# EAGLE board Tyr V4 (EAGLE 9.5.1), part 1 of 2
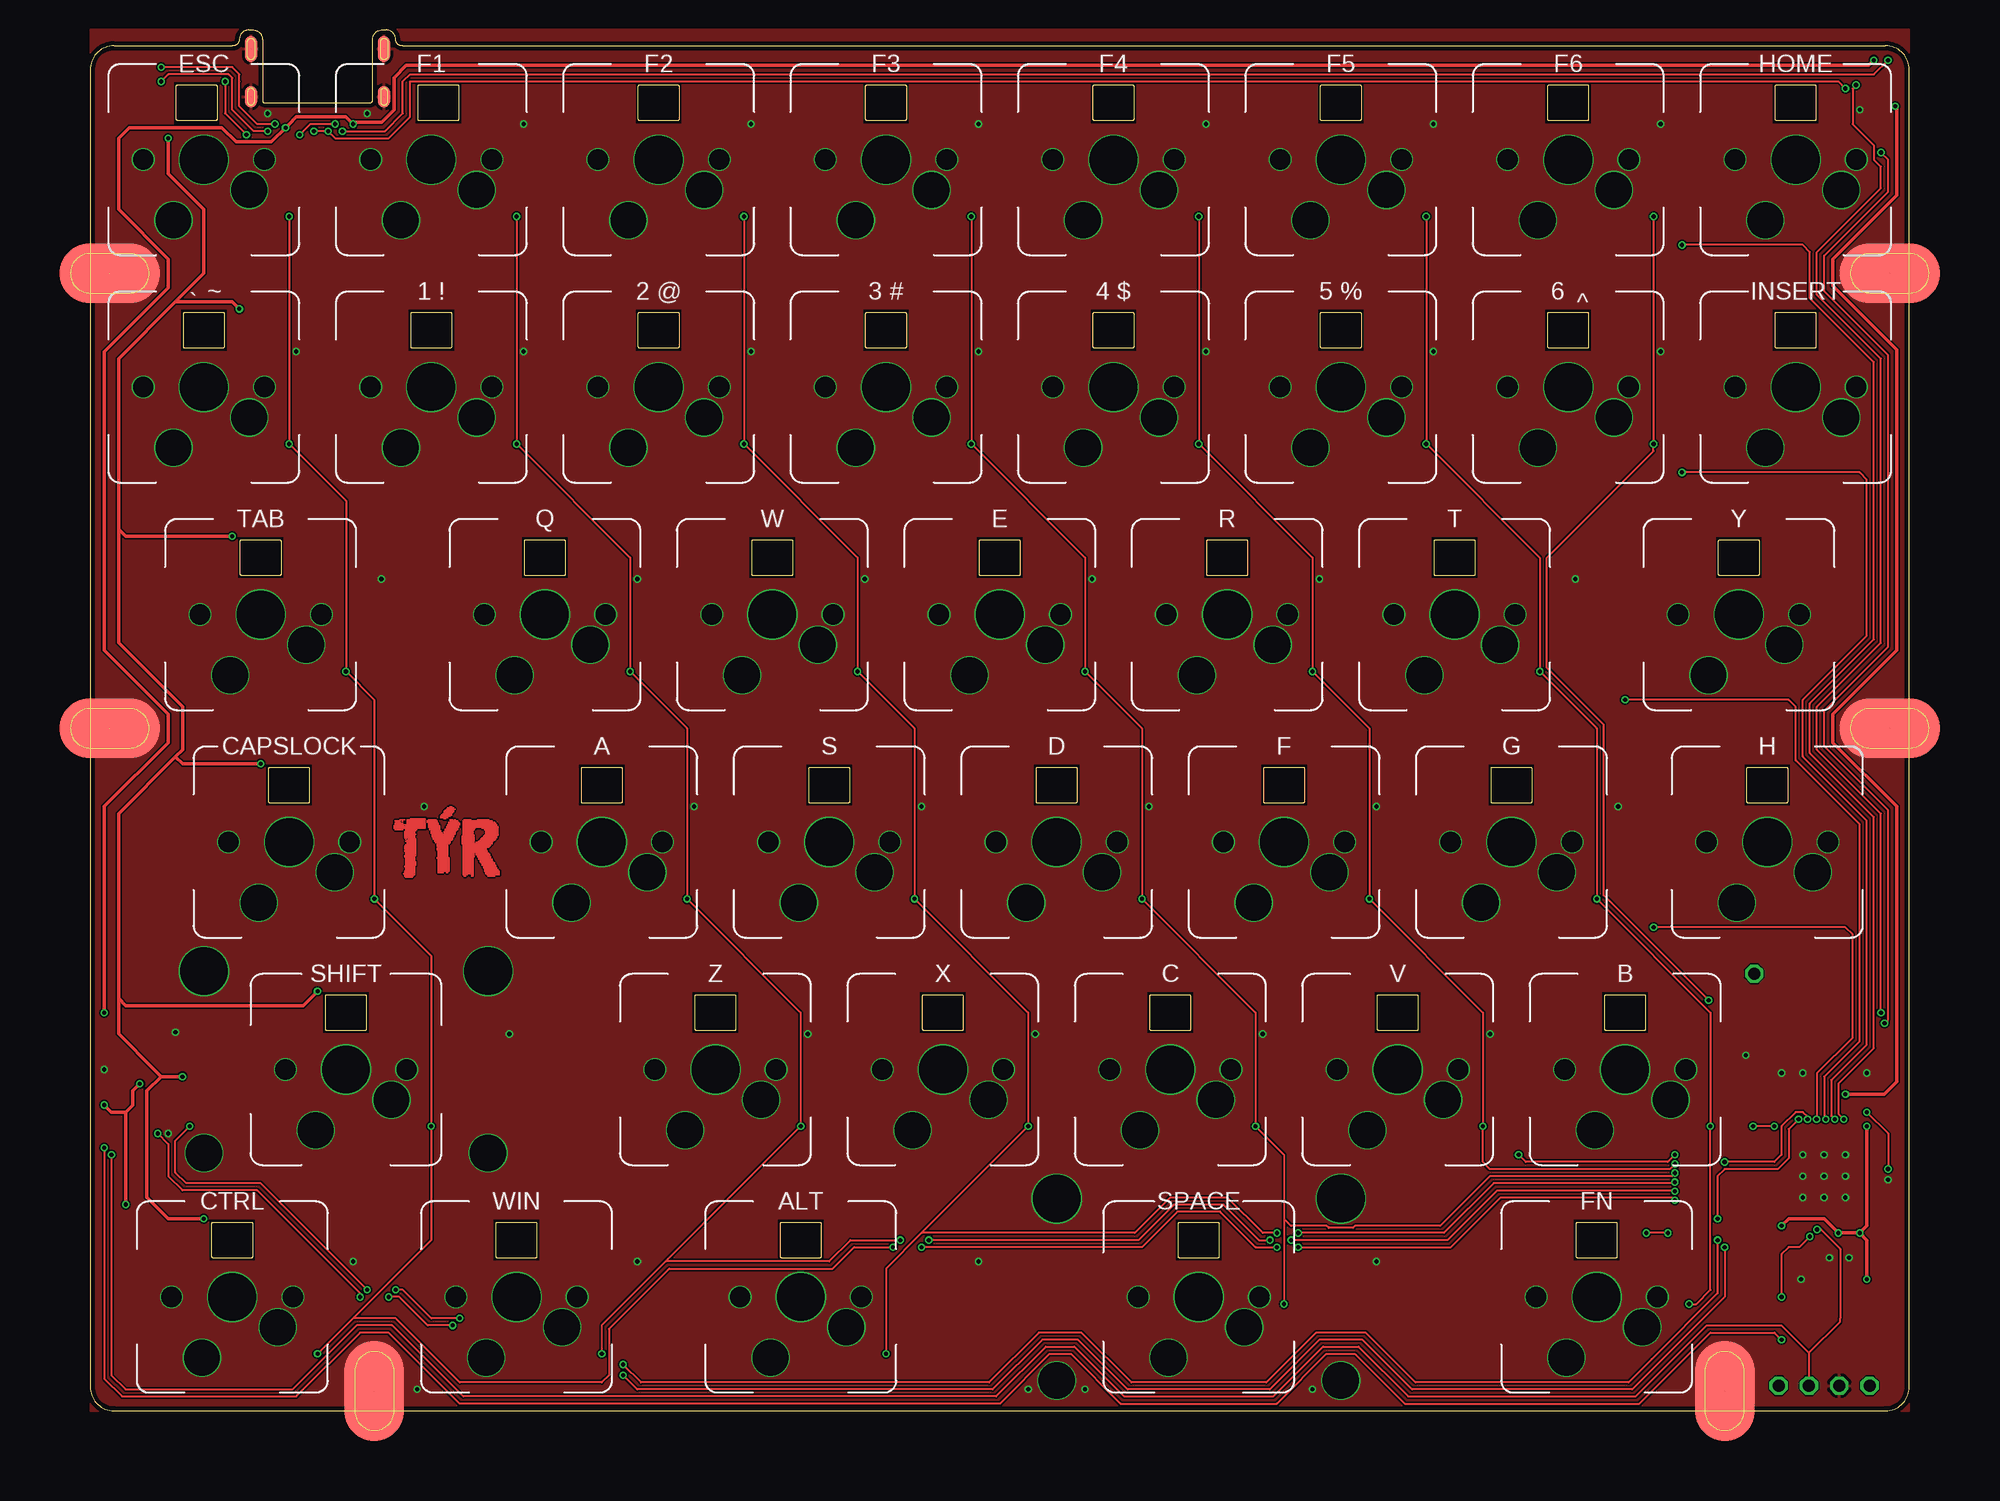
[diagram p3: board, top side]
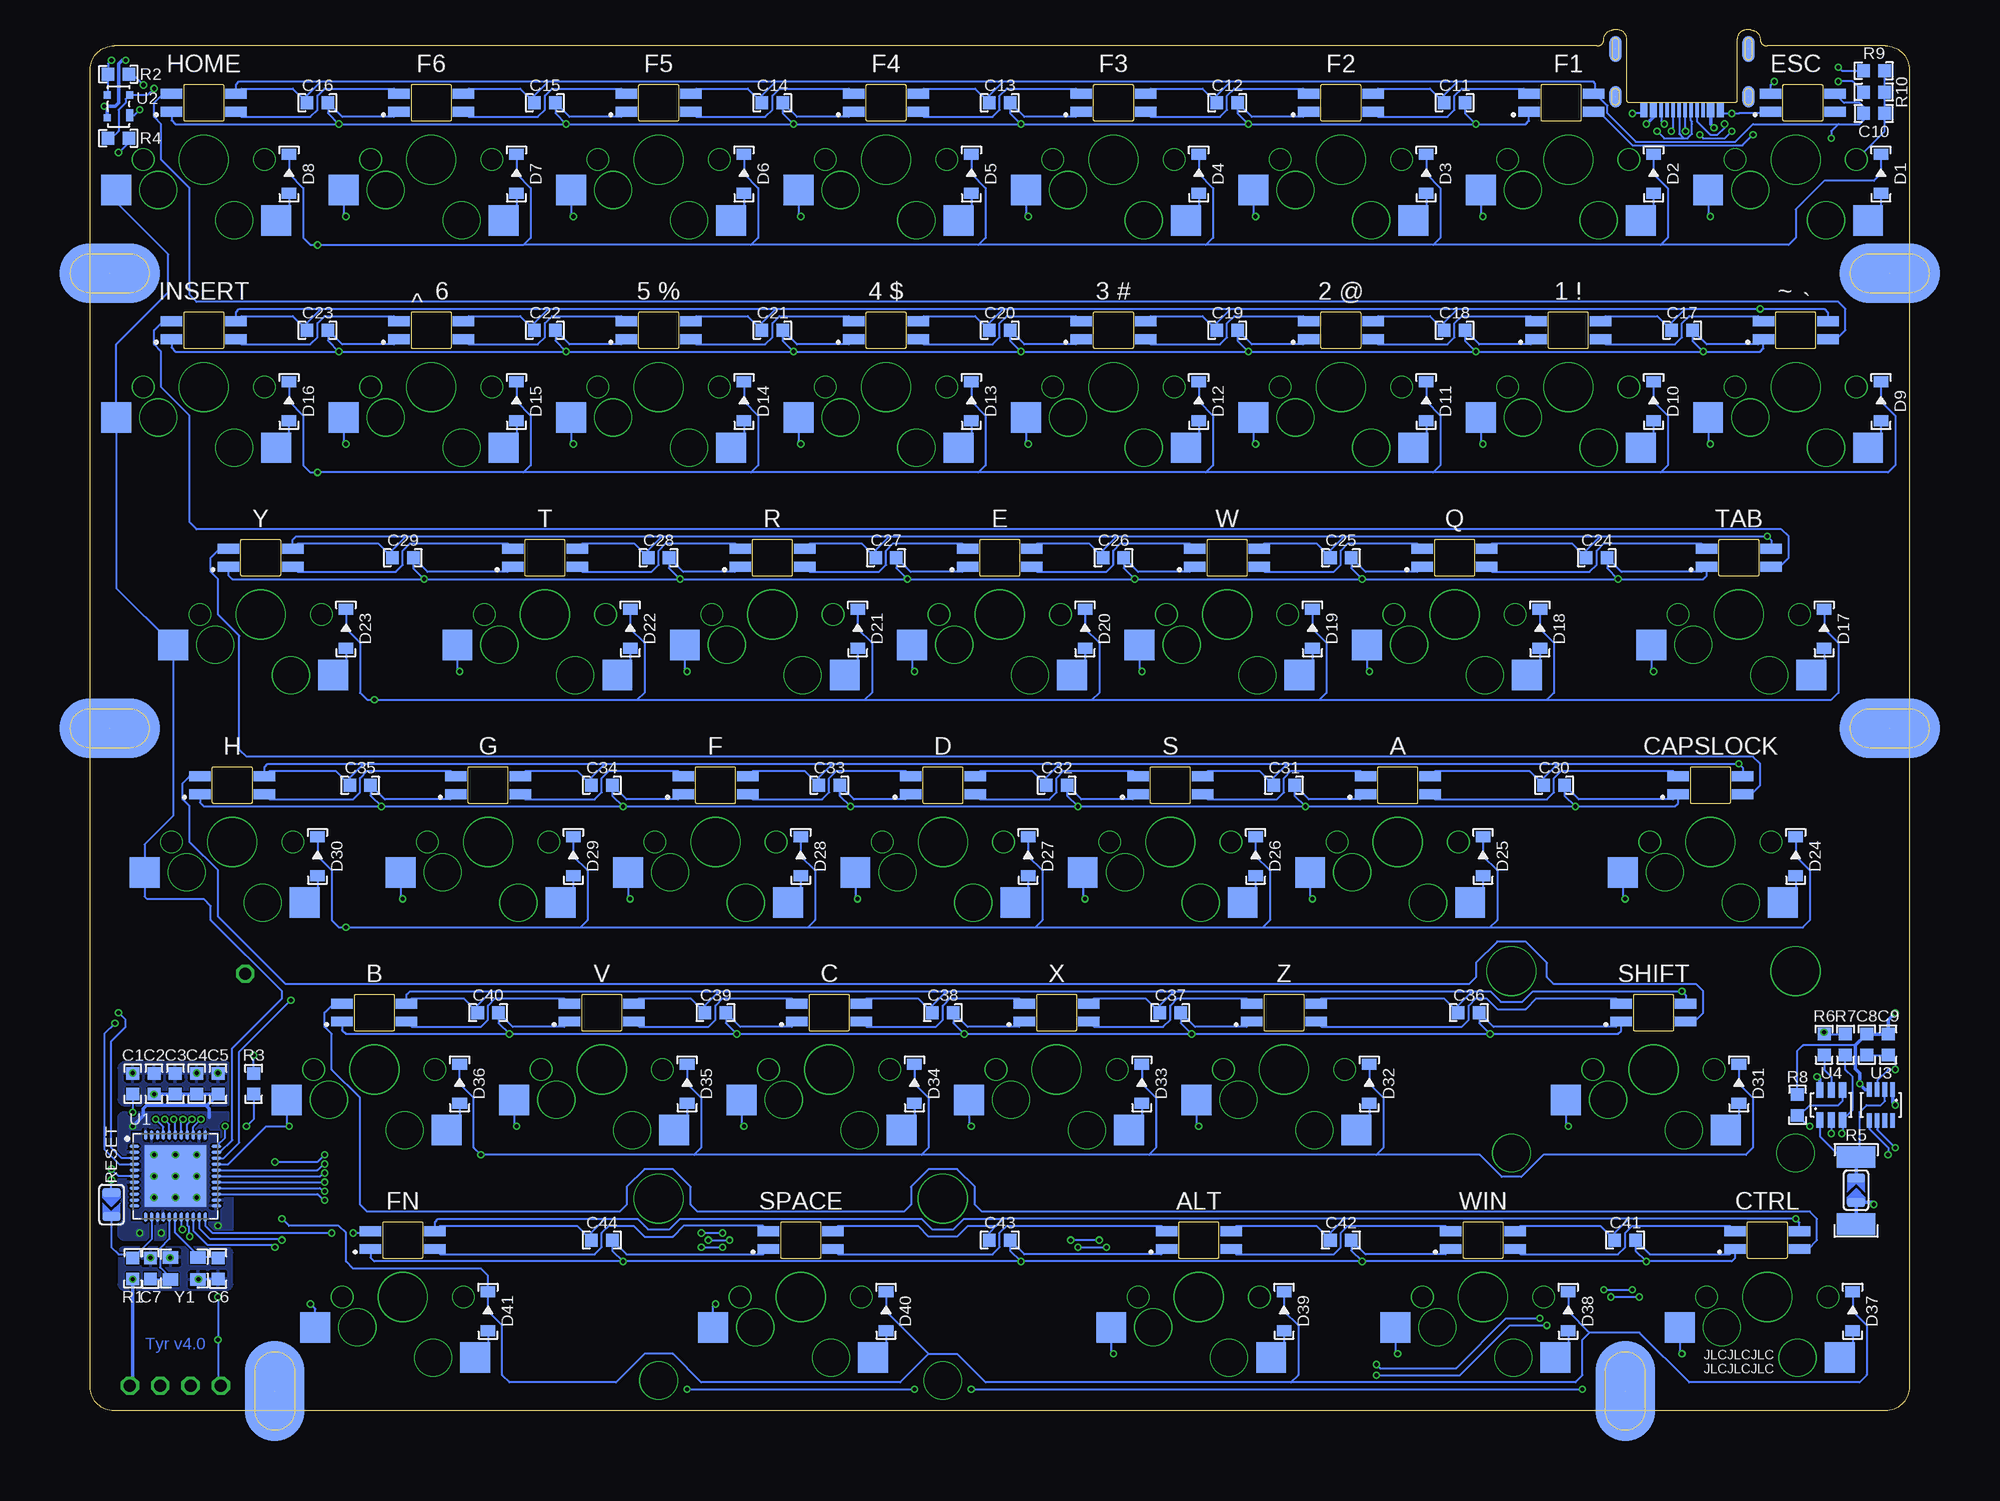
[diagram p4: board, bottom side, seen from below]

Size 152.4 x 115.64 mm. Coordinates in mm from the lower left corner, seen from the top.
Outline: 152.4,2 152.4,112.3 arc90 150.4,114.3 26.19,114.3 26.14,114.3 arc-90 25.6,114.84 arc90 24.8,115.64 24.46,115.64 arc90 23.66,114.84 23.66,109.74 arc-90 23.46,109.54 14.64,109.54 arc-90 14.44,109.74 14.44,114.84 arc90 13.64,115.64 13.3,115.64 arc90 12.5,114.84 arc-90 11.96,114.3 11.91,114.3 2,114.3 arc90 0,112.3 0,2 arc90 2,0 150.4,0 arc90 152.4,2
Copper layers (1*16): Top 0.035559375mm / dielectric 1.6mm / Bottom 0.035559375mm
Design rules "oshpark-2layer *": minimum track width 5mil, minimum drill 10mil, track to track 5mil, track to pad 6mil, pad to pad 6mil, via to via 6mil, smd to smd 6mil, copper to edge 15mil, drill to drill 6mil, minimum pad ring 3mil, minimum via ring 5mil, stop-mask expansion 2.5mil, vias tented up to drill 20mil, thermal gap 10mil
tRestrict: area 14.3,109.2 to 23.8,115.8
bRestrict: area 14.3,109.2 to 23.8,115.8

## Footprints (pad centres in the part's own frame; a part is rotated, then mirrored left to right if it is on the bottom)
KEYBOARD_MX-1U-HOTSWAP = drill 4 pad 4.2: HOLE1 0,0 | drill 3 pad 3.2: HOLE2 2.54,5.08; HOLE3 -3.81,2.54 | drill 1.7 pad 1.9: HOLE4 -5.08,0; HOLE5 5.08,0 | smd 2.5 x 2.55 bottom: P$1 -7.335,2.54; P$2 6.065,5.08
COMPONENTS_C0603 = smd 1.05 x 1.08: 1 -0.875,0; 2 0.875,0
KEYBOARD_MX-1U-HOTSWAP-CAPSLOCK = drill 4 pad 4.2: HOLE1 0,0 | drill 3 pad 3.2: HOLE2 2.54,5.08; HOLE3 -3.81,2.54 | drill 1.7 pad 1.9: HOLE4 -5.08,0; HOLE5 5.08,0 | smd 2.5 x 2.55 bottom: P$1 -7.335,2.54; P$2 6.065,5.08
COMPONENTS_SOD-123 = smd 0.91 x 1.22: A -1.635,0; C 1.635,0
HOLE_M3_OVAL = smd 8.4 x 5 bottom: P$1 0,0 | smd 8.4 x 5: P$2 0,0
TYR_TYR_DISPLAY = drill 1.016 pad 1.524 octagon: 5 1.288,36.6; GND 8.414,2.1; SCL 5.874,2.1; SDA 3.334,2.1; VIN 10.954,2.1
TYR_WS2812B_3528_REVERS-MOUNT = smd 1.8 x 0.82: DIN -2.7,0.75; DOUT 2.7,-0.75; GND -2.7,-0.75; VDD 2.7,0.75
COMPONENTS_R0603 = smd 1.05 x 1.08: 1 -0.875,0; 2 0.875,0
MICROBUILDER_2512 = smd 1.8 x 3.2: 1 -2.8,0; 2 2.8,0
KEYBOARD_MX-2U-HOTSWAP = drill 4 pad 4.2: HOLE1 0,0; HOLE6 -11.9,-8.24; HOLE7 11.9,-8.24 | drill 3 pad 3.2: HOLE2 2.54,5.08; HOLE3 -3.81,2.54 | drill 1.7 pad 1.9: HOLE4 -5.08,0; HOLE5 5.08,0 | drill 3.05 pad 3.25: HOLE8 -11.9,7; HOLE9 11.9,7 | smd 2.5 x 2.55 bottom: P$1 -7.335,2.54; P$2 6.065,5.08
MICROBUILDER_SOLDERJUMPER_ARROW_NOPASTE = smd 0.762 x 1.524: 1 -1.016,0; 2 1.016,0
TYR_QFN44-7X7 = smd 0.86 x 0.27: 1 -3.435,2.5; 2 -3.435,2; 3 -3.435,1.5; 4 -3.435,1; 5 -3.435,0.5; 6 -3.435,0; 7 -3.435,-0.5; 8 -3.435,-1; 9 -3.435,-1.5; 10 -3.435,-2; 11 -3.435,-2.5; 23 3.435,-2.5; 24 3.435,-2; 25 3.435,-1.5; 26 3.435,-1; 27 3.435,-0.5; 28 3.435,0; 29 3.435,0.5; 30 3.435,1; 31 3.435,1.5; 32 3.435,2; 33 3.435,2.5 | smd 0.27 x 0.86: 12 -2.5,-3.435; 13 -2,-3.435; 14 -1.5,-3.435; 15 -1,-3.435; 16 -0.5,-3.435; 17 0,-3.435; 18 0.5,-3.435; 19 1,-3.435; 20 1.5,-3.435; 21 2,-3.435; 22 2.5,-3.435; 34 2.5,3.435; 35 2,3.435; 36 1.5,3.435; 37 1,3.435; 38 0.5,3.435; 39 0,3.435; 40 -0.5,3.435; 41 -1,3.435; 42 -1.5,3.435; 43 -2,3.435; 44 -2.5,3.435 | smd 5.15 x 5.15: 45 0,0
CONTROLLER_PRTR5V0U2X = smd 1 x 0.6: 1 -0.75,-0.95 | smd 0.6 x 0.6: 2 0.95,-0.95; 3 0.95,0.95; 4 -0.95,0.95
MICROBUILDER_SOT23-8 = smd 0.4 x 1.2: 1 -0.975,-1.3; 2 -0.325,-1.3; 3 0.325,-1.3; 4 0.975,-1.3; 5 0.975,1.3; 6 0.325,1.3; 7 -0.325,1.3; 8 -0.975,1.3
TYR_SOT-23-6P = smd 1.3 x 0.6: 1 -1.25,0.95; 2 -1.25,0; 3 -1.25,-0.95; 4 1.25,-0.95; 5 1.25,0; 6 1.25,0.95
CONTROLLER_USB-C-12P-INBOARD = smd 0.3 x 1.15: CC1 -1.25,3; CC2 1.75,3; DN1 0.25,3; DN2 -0.75,3; DP1 -0.25,3; DP2 0.75,3; SBU1 -1.75,3; SBU2 1.25,3 | smd 0.6 x 1.15: GND1 -3.2,3; GND2 3.2,3; VBUS1 -2.4,3; VBUS2 2.4,3 | smd 1 x 1.8: P$1 -5.575,1.875; P$2 5.575,1.875 | smd 1 x 1.8 bottom: P$3 -5.575,1.875; P$4 5.575,1.875 | smd 1 x 2.2: P$5 -5.575,-2.125; P$6 5.575,-2.125 | smd 1 x 2.2 bottom: P$8 -5.575,-2.125; P$9 5.575,-2.125
CONTROLLER_CRYSTAL-3.2X2.5 = smd 1.3 x 1.05: 1 -1.15,-0.925; 2 1.15,-0.925; 3 1.15,0.925; 4 -1.15,0.925

## Placement (x,y rotation side)
1  KEYBOARD_KEYSWITCH-MX-1U-HOTSWAP  [KEYBOARD_MX-1U-HOTSWAP]  28.57,85.72 180 top
2  KEYBOARD_KEYSWITCH-MX-1U-HOTSWAP  [KEYBOARD_MX-1U-HOTSWAP]  47.62,85.72 180 top
3  KEYBOARD_KEYSWITCH-MX-1U-HOTSWAP  [KEYBOARD_MX-1U-HOTSWAP]  66.67,85.72 180 top
4  KEYBOARD_KEYSWITCH-MX-1U-HOTSWAP  [KEYBOARD_MX-1U-HOTSWAP]  85.72,85.72 180 top
5  KEYBOARD_KEYSWITCH-MX-1U-HOTSWAP  [KEYBOARD_MX-1U-HOTSWAP]  104.78,85.72 180 top
6  KEYBOARD_KEYSWITCH-MX-1U-HOTSWAP  [KEYBOARD_MX-1U-HOTSWAP]  123.83,85.72 180 top
A  KEYBOARD_KEYSWITCH-MX-1U-HOTSWAP  [KEYBOARD_MX-1U-HOTSWAP]  42.86,47.62 180 top
ALT  KEYBOARD_KEYSWITCH-MX-1U-HOTSWAP  [KEYBOARD_MX-1U-HOTSWAP]  59.53,9.53 180 top
B  KEYBOARD_KEYSWITCH-MX-1U-HOTSWAP  [KEYBOARD_MX-1U-HOTSWAP]  128.59,28.57 180 top
C  KEYBOARD_KEYSWITCH-MX-1U-HOTSWAP  [KEYBOARD_MX-1U-HOTSWAP]  90.49,28.57 180 top
C1  1u  [COMPONENTS_C0603]  148.83,27.38 270 bottom
C2  0.1u  [COMPONENTS_C0603]  147.04,27.38 270 bottom
C3  0.1u  [COMPONENTS_C0603]  145.26,27.38 270 bottom
C4  0.1u  [COMPONENTS_C0603]  143.47,27.38 270 bottom
C5  4.7u  [COMPONENTS_C0603]  141.68,27.38 270 bottom
C6  22p  [COMPONENTS_C0603]  141.68,11.91 90 bottom
C7  22p  [COMPONENTS_C0603]  147.34,11.91 270 bottom
C8  0.1u  [COMPONENTS_C0603]  3.57,30.66 90 bottom
C9  0.1u  [COMPONENTS_C0603]  1.79,30.66 90 bottom
C10  104  [COMPONENTS_C0603]  2.98,108.64 180 bottom
C11  104  [COMPONENTS_C0603]  38.1,109.54 180 bottom
C12  104  [COMPONENTS_C0603]  57.15,109.54 180 bottom
C13  104  [COMPONENTS_C0603]  76.2,109.54 180 bottom
C14  104  [COMPONENTS_C0603]  95.25,109.54 180 bottom
C15  104  [COMPONENTS_C0603]  114.3,109.54 180 bottom
C16  104  [COMPONENTS_C0603]  133.35,109.54 180 bottom
C17  104  [COMPONENTS_C0603]  19.05,90.49 180 bottom
C18  104  [COMPONENTS_C0603]  38.1,90.49 180 bottom
C19  104  [COMPONENTS_C0603]  57.15,90.49 180 bottom
C20  104  [COMPONENTS_C0603]  76.2,90.49 180 bottom
C21  104  [COMPONENTS_C0603]  95.25,90.49 180 bottom
C22  104  [COMPONENTS_C0603]  114.3,90.49 180 bottom
C23  104  [COMPONENTS_C0603]  133.35,90.49 180 bottom
C24  104  [COMPONENTS_C0603]  26.19,71.44 180 bottom
C25  104  [COMPONENTS_C0603]  47.62,71.44 180 bottom
C26  104  [COMPONENTS_C0603]  66.67,71.44 180 bottom
C27  104  [COMPONENTS_C0603]  85.72,71.44 180 bottom
C28  104  [COMPONENTS_C0603]  104.78,71.44 180 bottom
C29  104  [COMPONENTS_C0603]  126.21,71.44 180 bottom
C30  104  [COMPONENTS_C0603]  29.77,52.39 180 bottom
C31  104  [COMPONENTS_C0603]  52.39,52.39 180 bottom
C32  104  [COMPONENTS_C0603]  71.44,52.39 180 bottom
C33  104  [COMPONENTS_C0603]  90.49,52.39 180 bottom
C34  104  [COMPONENTS_C0603]  109.54,52.39 180 bottom
C35  104  [COMPONENTS_C0603]  129.78,52.39 180 bottom
C36  104  [COMPONENTS_C0603]  36.91,33.34 180 bottom
C37  104  [COMPONENTS_C0603]  61.91,33.34 180 bottom
C38  104  [COMPONENTS_C0603]  80.96,33.34 180 bottom
C39  104  [COMPONENTS_C0603]  100.01,33.34 180 bottom
C40  104  [COMPONENTS_C0603]  119.06,33.34 180 bottom
C41  104  [COMPONENTS_C0603]  23.81,14.29 180 bottom
C42  104  [COMPONENTS_C0603]  47.62,14.29 180 bottom
C43  104  [COMPONENTS_C0603]  76.2,14.29 180 bottom
C44  104  [COMPONENTS_C0603]  109.54,14.29 180 bottom
CAPSLOCK  KEYBOARD_KEYSWITCH-MX-1U-HOTSWAPCAPSLOCK  [KEYBOARD_MX-1U-HOTSWAP-CAPSLOCK]  16.67,47.62 180 top
CTRL  KEYBOARD_KEYSWITCH-MX-1U-HOTSWAP  [KEYBOARD_MX-1U-HOTSWAP]  11.91,9.53 180 top
D  KEYBOARD_KEYSWITCH-MX-1U-HOTSWAP  [KEYBOARD_MX-1U-HOTSWAP]  80.96,47.62 180 top
D1  1N4148  [COMPONENTS_SOD-123]  2.38,103.58 90 bottom
D2  1N4148  [COMPONENTS_SOD-123]  21.43,103.58 90 bottom
D3  1N4148  [COMPONENTS_SOD-123]  40.48,103.58 90 bottom
D4  1N4148  [COMPONENTS_SOD-123]  59.53,103.58 90 bottom
D5  1N4148  [COMPONENTS_SOD-123]  78.58,103.58 90 bottom
D6  1N4148  [COMPONENTS_SOD-123]  97.63,103.58 90 bottom
D7  1N4148  [COMPONENTS_SOD-123]  116.68,103.58 90 bottom
D8  1N4148  [COMPONENTS_SOD-123]  135.73,103.58 90 bottom
D9  1N4148  [COMPONENTS_SOD-123]  2.38,84.53 90 bottom
D10  1N4148  [COMPONENTS_SOD-123]  21.43,84.53 90 bottom
D11  1N4148  [COMPONENTS_SOD-123]  40.48,84.53 90 bottom
D12  1N4148  [COMPONENTS_SOD-123]  59.53,84.53 90 bottom
D13  1N4148  [COMPONENTS_SOD-123]  78.58,84.53 90 bottom
D14  1N4148  [COMPONENTS_SOD-123]  97.63,84.53 90 bottom
D15  1N4148  [COMPONENTS_SOD-123]  116.68,84.53 90 bottom
D16  1N4148  [COMPONENTS_SOD-123]  135.73,84.53 90 bottom
D17  1N4148  [COMPONENTS_SOD-123]  7.14,65.48 90 bottom
D18  1N4148  [COMPONENTS_SOD-123]  30.96,65.48 90 bottom
D19  1N4148  [COMPONENTS_SOD-123]  50.01,65.48 90 bottom
D20  1N4148  [COMPONENTS_SOD-123]  69.06,65.48 90 bottom
D21  1N4148  [COMPONENTS_SOD-123]  88.11,65.48 90 bottom
D22  1N4148  [COMPONENTS_SOD-123]  107.16,65.48 90 bottom
D23  1N4148  [COMPONENTS_SOD-123]  130.97,65.48 90 bottom
D24  1N4148  [COMPONENTS_SOD-123]  9.53,46.43 90 bottom
D25  1N4148  [COMPONENTS_SOD-123]  35.72,46.43 90 bottom
D26  1N4148  [COMPONENTS_SOD-123]  54.77,46.43 90 bottom
D27  1N4148  [COMPONENTS_SOD-123]  73.82,46.43 90 bottom
D28  1N4148  [COMPONENTS_SOD-123]  92.87,46.43 90 bottom
D29  1N4148  [COMPONENTS_SOD-123]  111.92,46.43 90 bottom
D30  1N4148  [COMPONENTS_SOD-123]  133.35,46.43 90 bottom
D31  1N4148  [COMPONENTS_SOD-123]  14.29,27.38 90 bottom
D32  1N4148  [COMPONENTS_SOD-123]  45.24,27.38 90 bottom
D33  1N4148  [COMPONENTS_SOD-123]  64.29,27.38 90 bottom
D34  1N4148  [COMPONENTS_SOD-123]  83.34,27.38 90 bottom
D35  1N4148  [COMPONENTS_SOD-123]  102.39,27.38 90 bottom
D36  1N4148  [COMPONENTS_SOD-123]  121.44,27.38 90 bottom
D37  1N4148  [COMPONENTS_SOD-123]  4.76,8.33 90 bottom
D38  1N4148  [COMPONENTS_SOD-123]  28.57,8.33 90 bottom
D39  1N4148  [COMPONENTS_SOD-123]  52.39,8.33 90 bottom
D40  1N4148  [COMPONENTS_SOD-123]  85.72,8.33 90 bottom
D41  1N4148  [COMPONENTS_SOD-123]  119.06,8.33 90 bottom
E  KEYBOARD_KEYSWITCH-MX-1U-HOTSWAP  [KEYBOARD_MX-1U-HOTSWAP]  76.2,66.67 180 top
ESC  KEYBOARD_KEYSWITCH-MX-1U-HOTSWAP  [KEYBOARD_MX-1U-HOTSWAP]  9.53,104.78 180 top
F  KEYBOARD_KEYSWITCH-MX-1U-HOTSWAP  [KEYBOARD_MX-1U-HOTSWAP]  100.01,47.62 180 top
F1  KEYBOARD_KEYSWITCH-MX-1U-HOTSWAP  [KEYBOARD_MX-1U-HOTSWAP]  28.57,104.78 180 top
F2  KEYBOARD_KEYSWITCH-MX-1U-HOTSWAP  [KEYBOARD_MX-1U-HOTSWAP]  47.62,104.78 180 top
F3  KEYBOARD_KEYSWITCH-MX-1U-HOTSWAP  [KEYBOARD_MX-1U-HOTSWAP]  66.67,104.78 180 top
F4  KEYBOARD_KEYSWITCH-MX-1U-HOTSWAP  [KEYBOARD_MX-1U-HOTSWAP]  85.72,104.78 180 top
F5  KEYBOARD_KEYSWITCH-MX-1U-HOTSWAP  [KEYBOARD_MX-1U-HOTSWAP]  104.78,104.78 180 top
F6  KEYBOARD_KEYSWITCH-MX-1U-HOTSWAP  [KEYBOARD_MX-1U-HOTSWAP]  123.83,104.78 180 top
FN  KEYBOARD_KEYSWITCH-MX-1U-HOTSWAP  [KEYBOARD_MX-1U-HOTSWAP]  126.21,9.53 180 top
G  KEYBOARD_KEYSWITCH-MX-1U-HOTSWAP  [KEYBOARD_MX-1U-HOTSWAP]  119.06,47.62 180 top
GRAVE  KEYBOARD_KEYSWITCH-MX-1U-HOTSWAP  [KEYBOARD_MX-1U-HOTSWAP]  9.53,85.72 180 top
H  KEYBOARD_KEYSWITCH-MX-1U-HOTSWAP  [KEYBOARD_MX-1U-HOTSWAP]  140.49,47.62 180 top
HOLE1  HOLE_MOUNT_HOLE  [HOLE_M3_OVAL]  150.75,57.15 0 top
HOLE2  HOLE_MOUNT_HOLE  [HOLE_M3_OVAL]  1.65,57.15 0 top
HOLE3  HOLE_MOUNT_HOLE  [HOLE_M3_OVAL]  23.81,1.65 90 top
HOLE4  HOLE_MOUNT_HOLE  [HOLE_M3_OVAL]  1.65,95.25 0 top
HOLE5  HOLE_MOUNT_HOLE  [HOLE_M3_OVAL]  150.75,95.25 0 top
HOLE6  HOLE_MOUNT_HOLE  [HOLE_M3_OVAL]  136.92,1.65 90 top
HOME  KEYBOARD_KEYSWITCH-MX-1U-HOTSWAP  [KEYBOARD_MX-1U-HOTSWAP]  142.88,104.78 180 top
INSERT  KEYBOARD_KEYSWITCH-MX-1U-HOTSWAP  [KEYBOARD_MX-1U-HOTSWAP]  142.88,85.72 180 top
J1  TYR_TYR_DISPLAY  [TYR_TYR_DISPLAY]  138.11,0 0 top
LED1  TYR_WS2812B_3528_REVERS-MOUNT  [TYR_WS2812B_3528_REVERS-MOUNT]  8.93,109.54 0 bottom
LED2  TYR_WS2812B_3528_REVERS-MOUNT  [TYR_WS2812B_3528_REVERS-MOUNT]  29.17,109.54 0 bottom
LED3  TYR_WS2812B_3528_REVERS-MOUNT  [TYR_WS2812B_3528_REVERS-MOUNT]  47.62,109.54 0 bottom
LED4  TYR_WS2812B_3528_REVERS-MOUNT  [TYR_WS2812B_3528_REVERS-MOUNT]  66.67,109.54 0 bottom
LED5  TYR_WS2812B_3528_REVERS-MOUNT  [TYR_WS2812B_3528_REVERS-MOUNT]  85.72,109.54 0 bottom
LED6  TYR_WS2812B_3528_REVERS-MOUNT  [TYR_WS2812B_3528_REVERS-MOUNT]  104.78,109.54 0 bottom
LED7  TYR_WS2812B_3528_REVERS-MOUNT  [TYR_WS2812B_3528_REVERS-MOUNT]  123.83,109.54 0 bottom
LED8  TYR_WS2812B_3528_REVERS-MOUNT  [TYR_WS2812B_3528_REVERS-MOUNT]  142.88,109.54 0 bottom
LED9  TYR_WS2812B_3528_REVERS-MOUNT  [TYR_WS2812B_3528_REVERS-MOUNT]  9.53,90.49 0 bottom
LED10  TYR_WS2812B_3528_REVERS-MOUNT  [TYR_WS2812B_3528_REVERS-MOUNT]  28.57,90.49 0 bottom
LED11  TYR_WS2812B_3528_REVERS-MOUNT  [TYR_WS2812B_3528_REVERS-MOUNT]  47.62,90.49 0 bottom
LED12  TYR_WS2812B_3528_REVERS-MOUNT  [TYR_WS2812B_3528_REVERS-MOUNT]  66.67,90.49 0 bottom
LED13  TYR_WS2812B_3528_REVERS-MOUNT  [TYR_WS2812B_3528_REVERS-MOUNT]  85.72,90.49 0 bottom
LED14  TYR_WS2812B_3528_REVERS-MOUNT  [TYR_WS2812B_3528_REVERS-MOUNT]  104.78,90.49 0 bottom
LED15  TYR_WS2812B_3528_REVERS-MOUNT  [TYR_WS2812B_3528_REVERS-MOUNT]  123.83,90.49 0 bottom
LED16  TYR_WS2812B_3528_REVERS-MOUNT  [TYR_WS2812B_3528_REVERS-MOUNT]  142.88,90.49 0 bottom
LED17  TYR_WS2812B_3528_REVERS-MOUNT  [TYR_WS2812B_3528_REVERS-MOUNT]  14.29,71.44 0 bottom
LED18  TYR_WS2812B_3528_REVERS-MOUNT  [TYR_WS2812B_3528_REVERS-MOUNT]  38.1,71.44 0 bottom
LED19  TYR_WS2812B_3528_REVERS-MOUNT  [TYR_WS2812B_3528_REVERS-MOUNT]  57.15,71.44 0 bottom
LED20  TYR_WS2812B_3528_REVERS-MOUNT  [TYR_WS2812B_3528_REVERS-MOUNT]  76.2,71.44 0 bottom
LED21  TYR_WS2812B_3528_REVERS-MOUNT  [TYR_WS2812B_3528_REVERS-MOUNT]  95.25,71.44 0 bottom
LED22  TYR_WS2812B_3528_REVERS-MOUNT  [TYR_WS2812B_3528_REVERS-MOUNT]  114.3,71.44 0 bottom
LED23  TYR_WS2812B_3528_REVERS-MOUNT  [TYR_WS2812B_3528_REVERS-MOUNT]  138.11,71.44 0 bottom
LED24  TYR_WS2812B_3528_REVERS-MOUNT  [TYR_WS2812B_3528_REVERS-MOUNT]  16.67,52.39 0 bottom
LED25  TYR_WS2812B_3528_REVERS-MOUNT  [TYR_WS2812B_3528_REVERS-MOUNT]  42.86,52.39 0 bottom
LED26  TYR_WS2812B_3528_REVERS-MOUNT  [TYR_WS2812B_3528_REVERS-MOUNT]  61.91,52.39 0 bottom
LED27  TYR_WS2812B_3528_REVERS-MOUNT  [TYR_WS2812B_3528_REVERS-MOUNT]  80.96,52.39 0 bottom
LED28  TYR_WS2812B_3528_REVERS-MOUNT  [TYR_WS2812B_3528_REVERS-MOUNT]  100.01,52.39 0 bottom
LED29  TYR_WS2812B_3528_REVERS-MOUNT  [TYR_WS2812B_3528_REVERS-MOUNT]  119.06,52.39 0 bottom
LED30  TYR_WS2812B_3528_REVERS-MOUNT  [TYR_WS2812B_3528_REVERS-MOUNT]  140.49,52.39 0 bottom
LED31  TYR_WS2812B_3528_REVERS-MOUNT  [TYR_WS2812B_3528_REVERS-MOUNT]  21.43,33.34 0 bottom
LED32  TYR_WS2812B_3528_REVERS-MOUNT  [TYR_WS2812B_3528_REVERS-MOUNT]  52.39,33.34 0 bottom
LED33  TYR_WS2812B_3528_REVERS-MOUNT  [TYR_WS2812B_3528_REVERS-MOUNT]  71.44,33.34 0 bottom
LED34  TYR_WS2812B_3528_REVERS-MOUNT  [TYR_WS2812B_3528_REVERS-MOUNT]  90.49,33.34 0 bottom
LED35  TYR_WS2812B_3528_REVERS-MOUNT  [TYR_WS2812B_3528_REVERS-MOUNT]  109.54,33.34 0 bottom
LED36  TYR_WS2812B_3528_REVERS-MOUNT  [TYR_WS2812B_3528_REVERS-MOUNT]  128.59,33.34 0 bottom
LED37  TYR_WS2812B_3528_REVERS-MOUNT  [TYR_WS2812B_3528_REVERS-MOUNT]  11.91,14.29 0 bottom
LED38  TYR_WS2812B_3528_REVERS-MOUNT  [TYR_WS2812B_3528_REVERS-MOUNT]  35.72,14.29 0 bottom
LED39  TYR_WS2812B_3528_REVERS-MOUNT  [TYR_WS2812B_3528_REVERS-MOUNT]  59.53,14.29 0 bottom
LED40  TYR_WS2812B_3528_REVERS-MOUNT  [TYR_WS2812B_3528_REVERS-MOUNT]  92.87,14.29 0 bottom
LED41  TYR_WS2812B_3528_REVERS-MOUNT  [TYR_WS2812B_3528_REVERS-MOUNT]  126.21,14.29 0 bottom
Q  KEYBOARD_KEYSWITCH-MX-1U-HOTSWAP  [KEYBOARD_MX-1U-HOTSWAP]  38.1,66.67 180 top
R  KEYBOARD_KEYSWITCH-MX-1U-HOTSWAP  [KEYBOARD_MX-1U-HOTSWAP]  95.25,66.67 180 top
R1  10k  [COMPONENTS_R0603]  148.83,11.91 90 bottom
R2  22  [COMPONENTS_R0603]  150.02,111.92 0 bottom
R3  10k  [COMPONENTS_R0603]  138.71,27.38 270 bottom
R4  22  [COMPONENTS_R0603]  150.02,106.56 0 bottom
R5  0.1/1% (PT2512FK-070R1L)  [MICROBUILDER_2512]  4.46,18.45 90 bottom
R6  54.9k  [COMPONENTS_R0603]  7.14,30.66 270 bottom
R7  10k  [COMPONENTS_R0603]  5.36,30.66 270 bottom
R8  100k  [COMPONENTS_R0603]  9.38,25.6 90 bottom
R9  5.1k  [COMPONENTS_R0603]  2.98,112.22 0 bottom
R10  5.1k  [COMPONENTS_R0603]  2.98,110.43 0 bottom
S  KEYBOARD_KEYSWITCH-MX-1U-HOTSWAP  [KEYBOARD_MX-1U-HOTSWAP]  61.91,47.62 180 top
SHIFT  KEYBOARD_KEYSWITCH-MX-2U-HOTSWAP  [KEYBOARD_MX-2U-HOTSWAP]  21.43,28.57 180 top
SJ1  [MICROBUILDER_SOLDERJUMPER_ARROW_NOPASTE]  150.61,17.26 270 bottom
SJ2  [MICROBUILDER_SOLDERJUMPER_ARROW_NOPASTE]  4.46,18.45 90 bottom
SPACE  KEYBOARD_KEYSWITCH-MX-2U-HOTSWAP  [KEYBOARD_MX-2U-HOTSWAP]  92.87,9.53 180 top
T  KEYBOARD_KEYSWITCH-MX-1U-HOTSWAP  [KEYBOARD_MX-1U-HOTSWAP]  114.3,66.67 180 top
TAB  KEYBOARD_KEYSWITCH-MX-1U-HOTSWAP  [KEYBOARD_MX-1U-HOTSWAP]  14.29,66.67 180 top
U1  TYR_ATMEGA32U4  [TYR_QFN44-7X7]  145.26,19.65 0 bottom
U2  CONTROLLER_PRTR5V0U2X  [CONTROLLER_PRTR5V0U2X]  150.02,109.24 90 bottom
U3  [MICROBUILDER_SOT23-8]  2.38,25.6 180 bottom
U4  TYR_TPS2552  [TYR_SOT-23-6P]  6.55,25.6 90 bottom
V  KEYBOARD_KEYSWITCH-MX-1U-HOTSWAP  [KEYBOARD_MX-1U-HOTSWAP]  109.54,28.57 180 top
W  KEYBOARD_KEYSWITCH-MX-1U-HOTSWAP  [KEYBOARD_MX-1U-HOTSWAP]  57.15,66.67 180 top
WIN  KEYBOARD_KEYSWITCH-MX-1U-HOTSWAP  [KEYBOARD_MX-1U-HOTSWAP]  35.72,9.53 180 top
X  KEYBOARD_KEYSWITCH-MX-1U-HOTSWAP  [KEYBOARD_MX-1U-HOTSWAP]  71.44,28.57 180 top
X1  CONTROLLER_USB-C-12PUSB-C-12P-INBOARD  [CONTROLLER_USB-C-12P-INBOARD]  19.05,111.92 180 bottom
Y  KEYBOARD_KEYSWITCH-MX-1U-HOTSWAP  [KEYBOARD_MX-1U-HOTSWAP]  138.11,66.67 180 top
Y1  16Mhz  [CONTROLLER_CRYSTAL-3.2X2.5]  144.51,11.91 180 bottom
Z  KEYBOARD_KEYSWITCH-MX-1U-HOTSWAP  [KEYBOARD_MX-1U-HOTSWAP]  52.39,28.57 180 top